# Altium schematic sheet 06_SD_CARD.SchDoc: SD Card
size 420 x 297 mm; Author: T. Ludemann; SheetNumber: 6; SheetTotal: 8; DocSize: DINA3
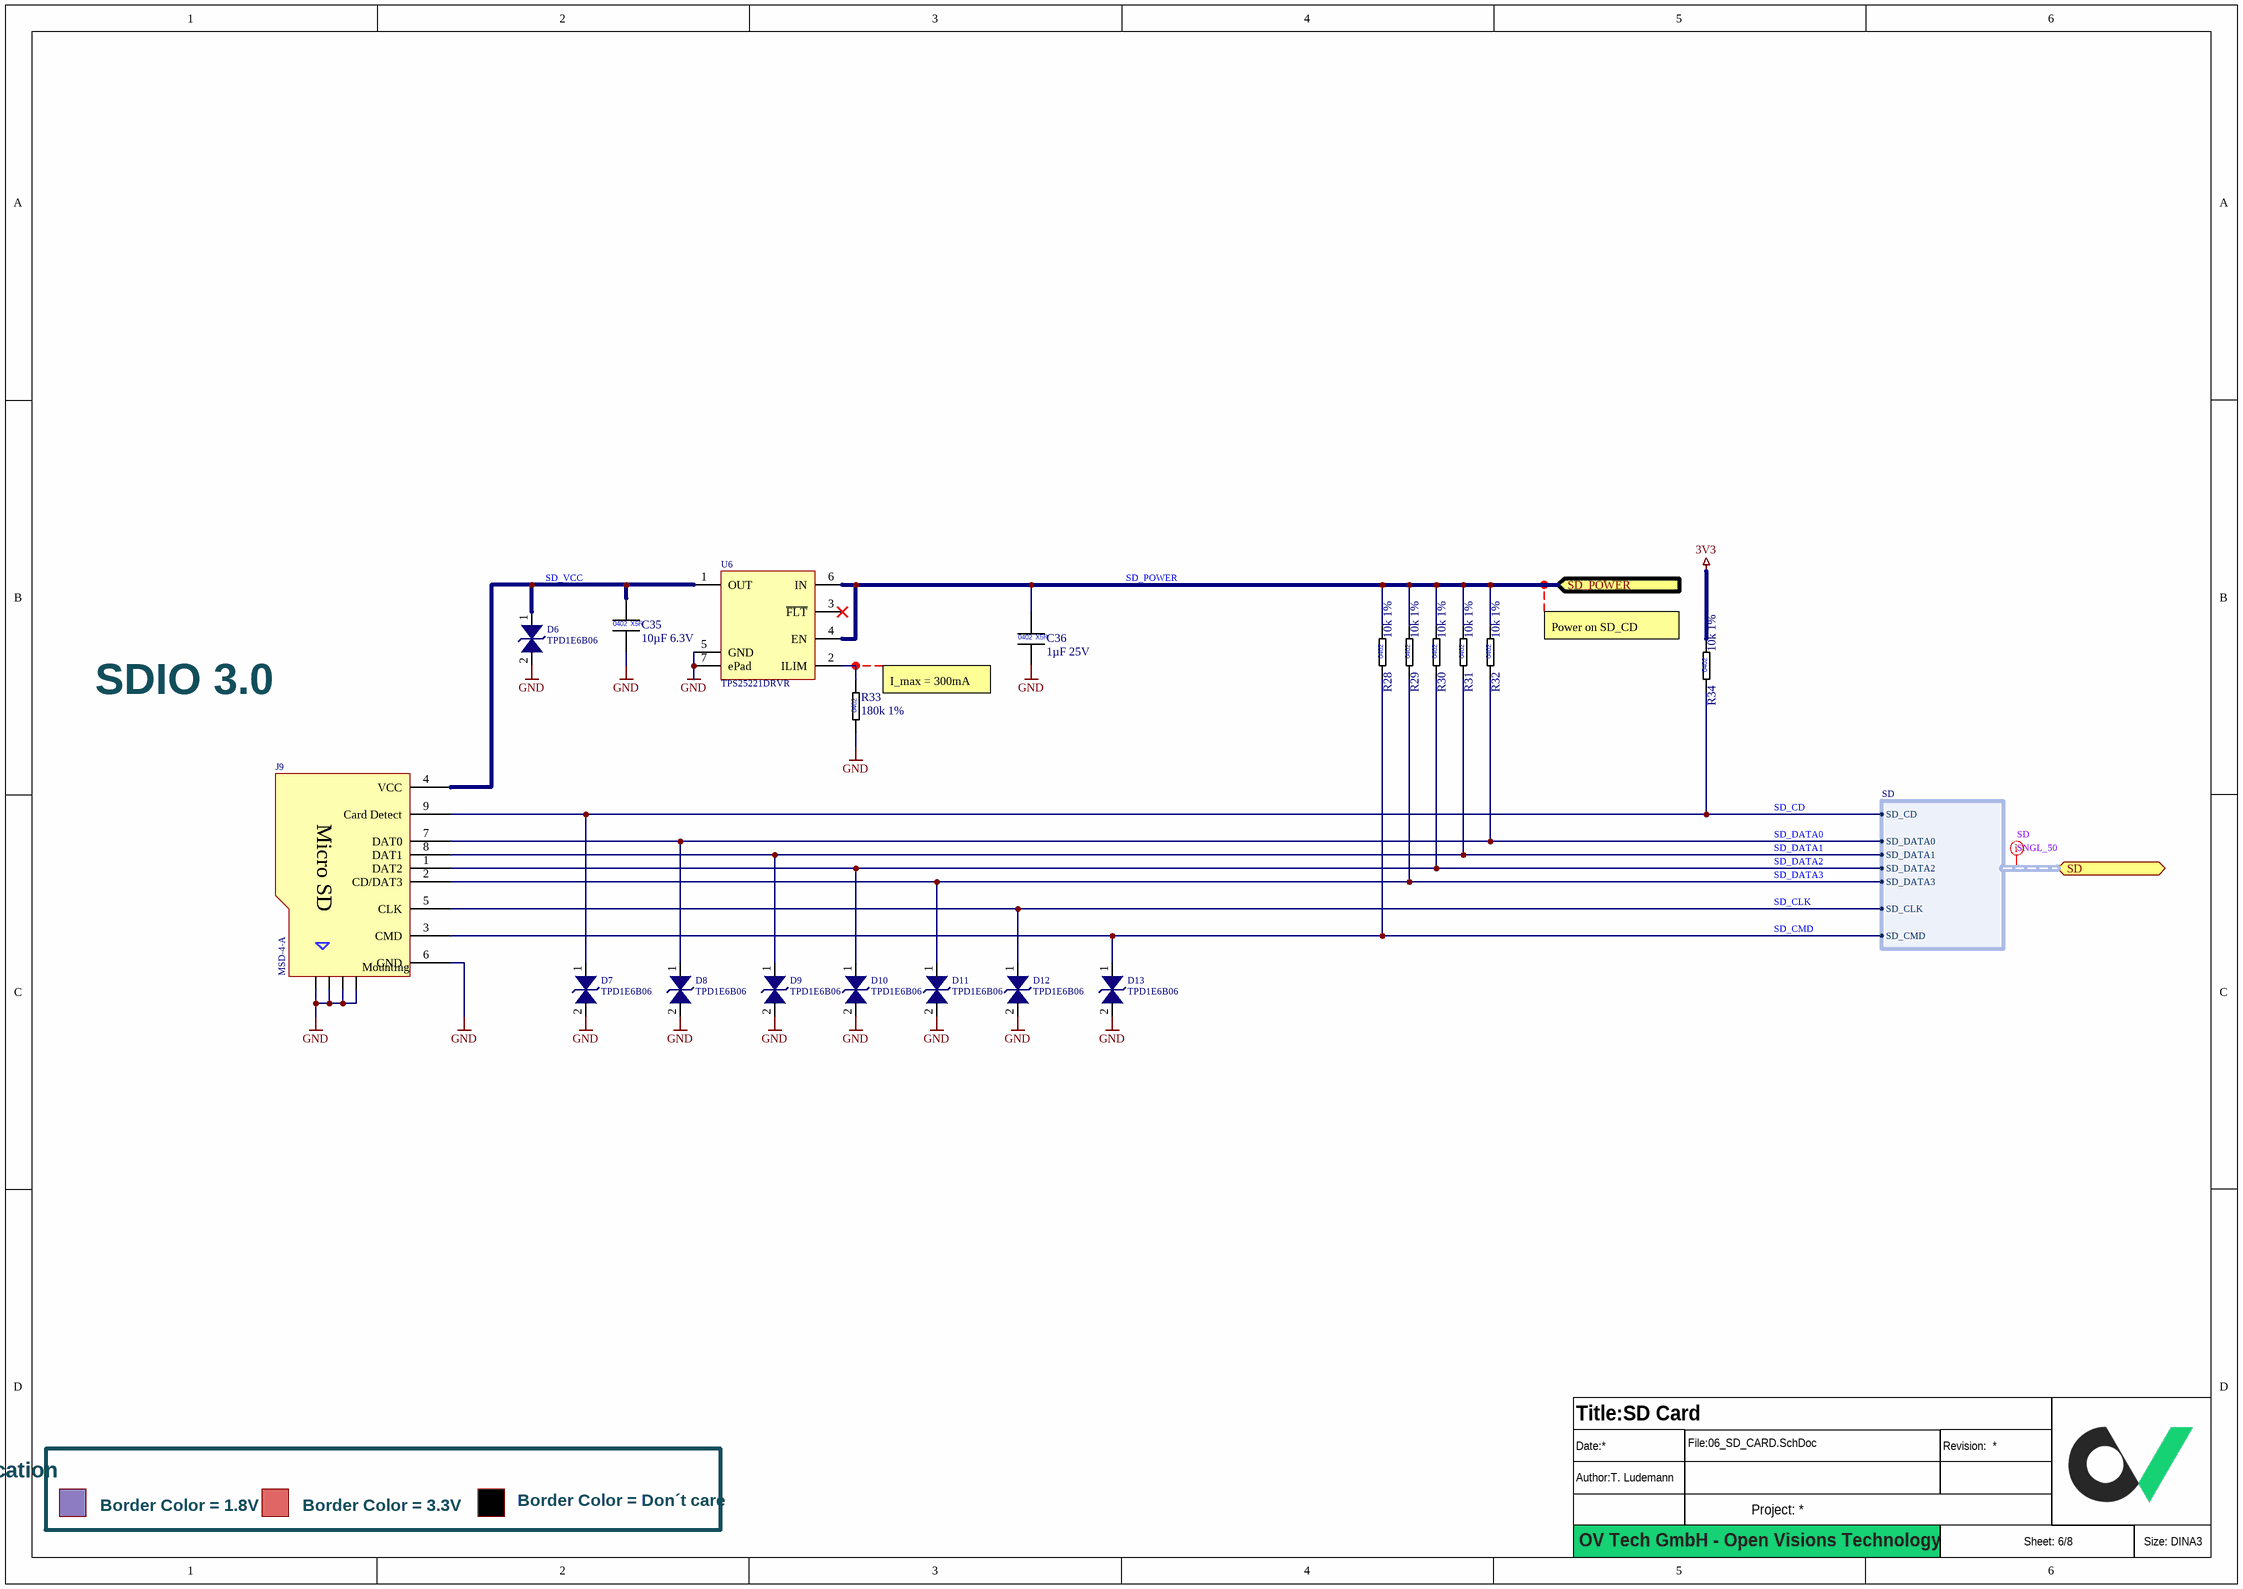
[diagram p0: 06_SD_CARD.SchDoc]

## Parts
?  (no value)  (graphical)
C35  10µF 6.3V  [CAPC1005X06L]
C36  1µF 25V  [CAPC1005X06L]
D6  TPD1E6B06  [DFN38P60X29-2L]
D7  TPD1E6B06  [DFN38P60X29-2L]
D8  TPD1E6B06  [DFN38P60X29-2L]
D9  TPD1E6B06  [DFN38P60X29-2L]
D10  TPD1E6B06  [DFN38P60X29-2L]
D11  TPD1E6B06  [DFN38P60X29-2L]
D12  TPD1E6B06  [DFN38P60X29-2L]
D13  TPD1E6B06  [DFN38P60X29-2L]
J9  MSD-4-A  [MicroSD Connector_MSD-4-A]
R28  10k 1%  [RESC1005X04L]
R29  10k 1%  [RESC1005X04L]
R30  10k 1%  [RESC1005X04L]
R31  10k 1%  [RESC1005X04L]
R32  10k 1%  [RESC1005X04L]
R33  180k 1%  [RESC1005X04L]
R34  10k 1%  [RESC1005X04L]
U6  TPS25221DRVR  [SON65P200X80_HS-7N]

## Ports
SD (bidir, harness SD), SD_POWER (in)

## Harnesses
SD: SD_CLK, SD_CMD, SD_CD, SD_DATA0, SD_DATA1, SD_DATA2, SD_DATA3

## Nets
3V3: R34.2
GND: C35.2 C36.2 D6.2 D7.2 D8.2 D9.2 D10.2 D11.2 D12.2 D13.2 J9.6(GND) J9.10 J9.11 J9.12 J9.13 R33.1 U6.5(GND) U6.7(ePad)
SD_CD: D7.1 J9.9(Card_Detect) R34.1 ; port SD.SD_CD
SD_CLK: D12.1 J9.5(CLK) ; port SD.SD_CLK
SD_CMD: D13.1 J9.3(CMD) R28.1 ; port SD.SD_CMD
SD_DATA0: D8.1 J9.7(DAT0) R32.1 ; port SD.SD_DATA0
SD_DATA1: D9.1 J9.8(DAT1) R31.1 ; port SD.SD_DATA1
SD_DATA2: D10.1 J9.1(DAT2) R30.1 ; port SD.SD_DATA2
SD_DATA3: D11.1 J9.2(CD/DAT3) R29.1 ; port SD.SD_DATA3
SD_POWER: C36.1 R28.2 R29.2 R30.2 R31.2 R32.2 U6.4(EN) U6.6(IN) ; port SD_POWER
SD_VCC: C35.1 D6.1 J9.4(VCC) U6.1(OUT)
NetR33_2: R33.2 U6.2(ILIM)

Not connected (* = marked no-connect by the designer): U6 3(~{FLT})*

## Layout directives
net class SD; net class SNGL_50: (no net found under the mark)

## Notes on the sheet
- (near R34) Power on SD_CD
- SDIO 3.0
- (near R33) I_max = 300mA
- Signal Level Indication
- Border Color = 1.8V
- Border Color = 3.3V
- Border Color = Don´t care
- OV Tech GmbH - Open Visions Technology
- (in symbol CAP_0402_1µ_25V) 0402; X5R
- (in symbol CAP_0402_10µ_6.3V) 0402; X5R
- (in symbol Micro SD Connector_MSD-4-A) Micro SD; Mounting
- (in symbol RES_0402_10k_1%) 0402
- (in symbol RES_0402_180k_1%) 0402

## Library data of the parts
? = Titleblock_01_OpenSource
C35 = CAP_0402_10µ_6.3V: Multilayer Ceramic Capacitors MLCC - SMD/SMT 0402 6.3VDC; Manufacturer 1: Murata Electronics; Manufacturer 1 Prt. Nr.: GRM155C80J106ME11J; Manufacturer 2 Prt. Nr.: JMK105CBJ106MV-F; Manufacturer 2: Taiyo Yuden
C36 = CAP_0402_1µ_25V: Multilayer Ceramic Capacitors MLCC - SMD/SMT 0402 25VDC; Manufacturer 1: Murata Electronics; Manufacturer 1 Prt. Nr.: GRM155R61E105KE11D; Manufacturer 2 Prt. Nr.: 0402X105K250CT; Manufacturer 2: Walsin
D6-D13 = ESD Protection Diode_3.6V_TPD1E6B06: 6pF ±5V ±15kV ESD protection diode in 0201 package; Manufacturer 1: Texas Instruments; Manufacturer 1 Prt. Nr.: TPD1E6B06
J9 = Micro SD Connector_MSD-4-A: Micro SD Card Connector, 9 Positions, Connector and Ejector, Push In, Auto Eject Out, Surface Mount, 1.8 mm Height Above Board, Gold Flash; Manufacturer 1: XUNPU; Manufacturer 1 Prt. Nr.: TF-115
R28-R32 R34 = RES_0402_10k_1%: Thick Film Resistors - SMD 10k 1%; Manufacturer 1: Vishay / Dale; Manufacturer 1 Prt. Nr.: CRCW040210K0FKEDC; Manufacturer 2 Prt. Nr.: RT0402FRE0710KL; Manufacturer 2: YAGEO
R33 = RES_0402_180k_1%: Thick Film Resistors - SMD 180k 1%; Manufacturer 1: Bourns; Manufacturer 1 Prt. Nr.: CR0402-JW-184GLF; Manufacturer 2 Prt. Nr.: CRGCQ0402F180K; Manufacturer 2: TE Connectivity / Holsworthy
U6 = Power Switch with programmable current limit TPS25221DRVR: 0.275-2.7A adj. ILIMIT, 2.5-5.5V, 70mΩ USB power switch, active-high, reverse blocking; Manufacturer 1: Texas Instruments; Manufacturer 1 Prt. Nr.: TPS25221DRVR